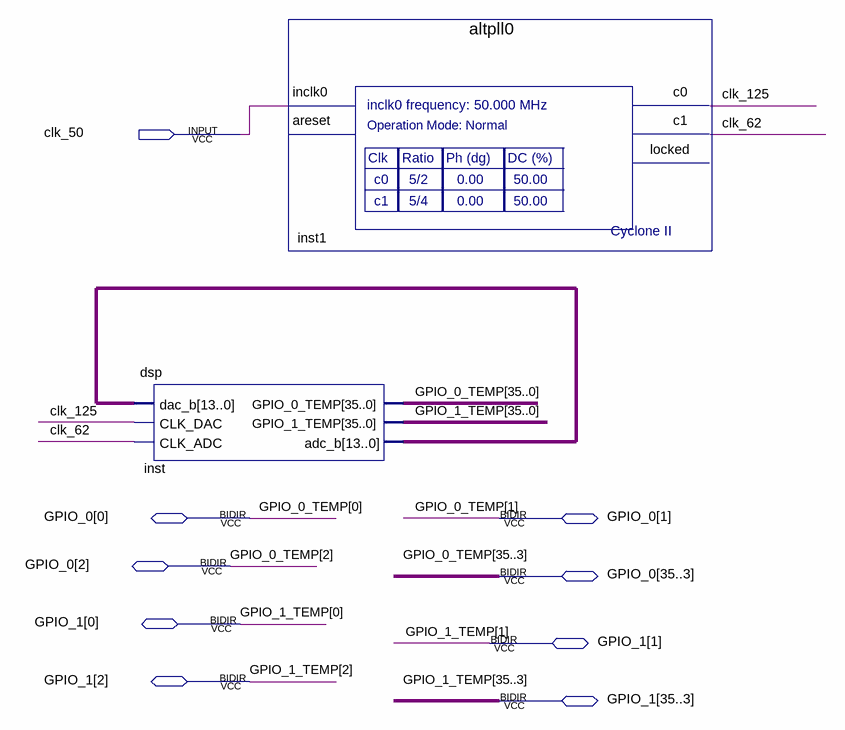
[diagram p0: schematic sheet]
// Quartus schematic lab7.bdf as structural Verilog: 2 symbols, 9 pins
module lab7 (
  input  clk_50,
  inout  [35:0] GPIO_0,
  inout  [35:0] GPIO_1
);

  wire clk_62, clk_125;
  wire [13:0] inst_adc_b;

  dsp inst (
    .dac_b(inst_adc_b), .CLK_DAC(clk_125), .CLK_ADC(clk_62), .adc_b(inst_adc_b), .GPIO_0_TEMP(GPIO_0),
    .GPIO_1_TEMP(GPIO_1));
  altpll0 inst1 (.inclk0(clk_50), .c0(clk_125), .c1(clk_62));  // open: areset, locked

  // Other names for the same wires on the sheet: GPIO_0_TEMP[35:0] = GPIO_0; GPIO_1_TEMP[35:0] = GPIO_1
endmodule
